# EAGLE schematic rpi_breakout (EAGLE 6.1)
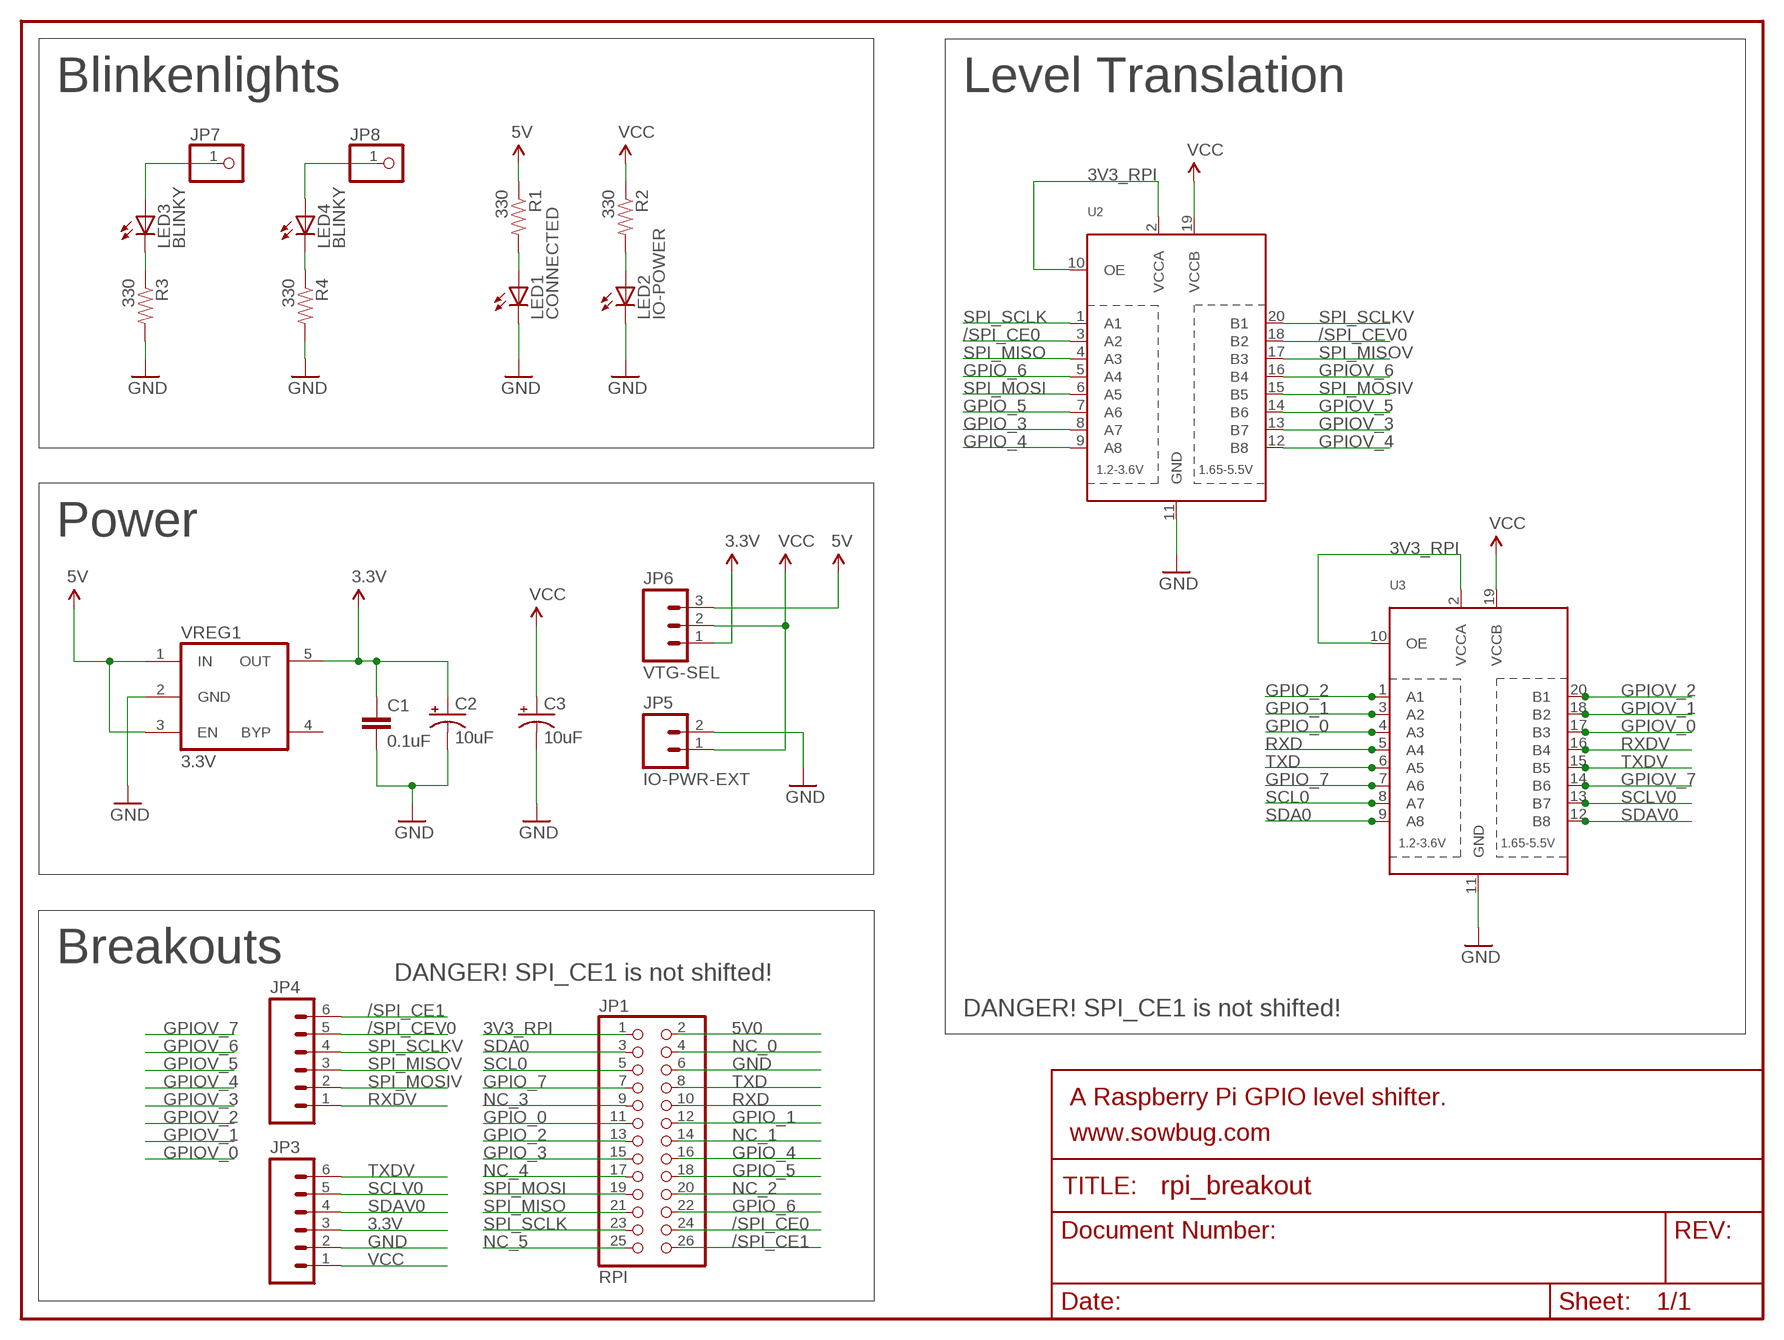
[diagram p0: schematic, sheet 1]

## Parts
C1  0.1uF  CAP0805  [0805]
C2  10uF  CAP_POL1206  [EIA3216]
C3  10uF  CAP_POL1206  [EIA3216]
JP1  RPI  PINHD-2X13  [2X13]
JP3  M06FEMALE_LOCK  [1X06_FEMALE_LOCK.010]
JP4  M06FEMALE_LOCK  [1X06_FEMALE_LOCK.010]
JP5  IO-PWR-EXT  M02PTH  [1X02]
JP6  VTG-SEL  M03PTH  [1X03]
JP7  PINHD-1X1CB  [1X01-CLEANBIG]
JP8  PINHD-1X1CB  [1X01-CLEANBIG]
LED1  CONNECTED  LEDCHIPLED_0805  [CHIPLED_0805]
LED2  IO-POWER  LEDCHIPLED_0805  [CHIPLED_0805]
LED3  BLINKY  LEDCHIPLED_0805  [CHIPLED_0805]
LED4  BLINKY  LEDCHIPLED_0805  [CHIPLED_0805]
R1  330  RESISTOR0805-RES  [0805]
R2  330  RESISTOR0805-RES  [0805]
R3  330  RESISTOR0805-RES  [0805]
R4  330  RESISTOR0805-RES  [0805]
U2  TXB0108PWR  [TSSOP20]
U3  TXB0108PWR  [TSSOP20]
VREG1  3.3V  IC_VREG_5PINS-SOT-23-5  [SOT-23-5]

## Nets
3.3V [power/gnd]: C1.1 C2.A(+) JP3.3 JP6.1 VREG1.5(OUT)
3V3_RPI: JP1.1 U2.2(VCCA) U2.10(OE) U3.2(VCCA) U3.10(OE)
5V [power/gnd]: JP6.3 R1.1 VREG1.1(IN) VREG1.3(EN)
5V0: JP1.2
/SPI_CE0: JP1.24 U2.3(A2)
/SPI_CE1: JP1.26 JP4.6
/SPI_CEV0: JP4.5 U2.18(B2)
GND [power/gnd]: C1.2 C2.C(-) C3.C(-) JP1.6 JP3.2 JP5.2 LED1.C LED2.C R3.2 R4.2 U2.11(GND) U3.11(GND) VREG1.2(GND)
GPIO_0: JP1.11 U3.4(A3)
GPIO_1: JP1.12 U3.3(A2)
GPIO_2: JP1.13 U3.1(A1)
GPIO_3: JP1.15 U2.8(A7)
GPIO_4: JP1.16 U2.9(A8)
GPIO_5: JP1.18 U2.7(A6)
GPIO_6: JP1.22 U2.5(A4)
GPIO_7: JP1.7 U3.7(A6)
GPIOV_0: JP2.1 U3.17(B3)
GPIOV_1: JP2.2 U3.18(B2)
GPIOV_2: JP2.3 U3.20(B1)
GPIOV_3: JP2.4 U2.13(B7)
GPIOV_4: JP2.5 U2.12(B8)
GPIOV_5: JP2.6 U2.14(B6)
GPIOV_6: JP2.7 U2.16(B4)
GPIOV_7: JP2.8 U3.14(B6)
LED3_JP: JP7.1 LED3.A
LED4_JP: JP8.1 LED4.A
N$1: LED1.A R1.2
N$2: LED2.A R2.2
N$3: LED3.C R3.1
N$4: LED4.C R4.1
NC_0: JP1.4
NC_1: JP1.14
NC_2: JP1.20
NC_3: JP1.9
NC_4: JP1.17
NC_5: JP1.25
RXD: JP1.10 U3.5(A4)
RXDV: JP4.1 U3.16(B4)
SCL0: JP1.5 U3.8(A7)
SCLV0: JP3.5 U3.13(B7)
SDA0: JP1.3 U3.9(A8)
SDAV0 [skinny]: JP3.4 U3.12(B8)
SPI_MISO: JP1.21 U2.4(A3)
SPI_MISOV: JP4.3 U2.17(B3)
SPI_MOSI: JP1.19 U2.6(A5)
SPI_MOSIV: JP4.2 U2.15(B5)
SPI_SCLK: JP1.23 U2.1(A1)
SPI_SCLKV: JP4.4 U2.20(B1)
TXD: JP1.8 U3.6(A5)
TXDV: JP3.6 U3.15(B5)
VCC [power/gnd]: C3.A(+) JP3.1 JP5.1 JP6.2 R2.1 U2.19(VCCB) U3.19(VCCB)
Unconnected: VREG1.4(BYP)

## Notes on the sheet
- Blinkenlights | Level Translation
- Power
- Breakouts
- DANGER! SPI_CE1 is not shifted!
- DANGER! SPI_CE1 is not shifted!
- A Raspberry Pi GPIO level shifter.
- www.sowbug.com

## Library data of the parts
C1 = SparkFun:CAP: Capacitor Standard 0603 ceramic capacitor, and 0.1" leaded capacitor.
C2 C3 = SparkFun:CAP_POL: Capacitor Polarized These are standard SMD and PTH capacitors. Normally 10uF, 47uF, and 100uF in electrolytic and tantalum varieties. Always verify the external diameter of the through hole cap, it varies with capacity, voltage, and manufacturer. The EIA devices should be standard.
JP1 = pinhead:PINHD-2X13: PIN HEADER
JP3 JP4 = SparkFun:M06: Header 6 Standard 6-pin 0.1" header. Use with straight break away headers (SKU : PRT-00116), right angle break away headers (PRT-00553), swiss pins (PRT-00743), machine pins (PRT-00117), and female headers (PRT-00115). Molex polarized connector foot print use with SKU : PRT-08094 with associated crimp pins and housings. NOTES ON THE VARIANTS LOCK and LOCK_LONGPADS... This footprint was designed to help hold the alignment of a through-hole component (i.e. 6-pin header) while soldering it into place. You may notice that each hole has been shifted either up or down by 0.005 of an inch from it's more standard position (which is a perfectly straight line). This slight alteration caused the pins (the squares in the middle) to touch the edges of the holes. Because they are alternating, it causes a "brace" to hold the component in place. 0.005 has proven to be the perfect amount of "off-center" position when using our standard breakaway headers. Although looks a little odd when you look at the bare footprint, once you have a header in there, the alteration is very hard to notice. Also, if you push a header all the way into place, it is covered up entirely on the bottom side. This idea of altering the position of holes to aid alignment will be further integrated into the Sparkfun Library for other footprints. It can help hold any component with 3 or more connection pins.
JP5 = SparkFun:M02: Header 2 Standard 2-pin 0.1" header. Use with straight break away headers (SKU : PRT-00116), right angle break away headers (PRT-00553), swiss pins (PRT-00743), machine pins (PRT-00117), and female headers (PRT-00115). Molex polarized connector foot print use with SKU : PRT-08233 with associated crimp pins and housings.
JP6 = SparkFun:M03: Header 3 Standard 3-pin 0.1" header. Use with straight break away headers (SKU : PRT-00116), right angle break away headers (PRT-00553), swiss pins (PRT-00743), machine pins (PRT-00117), and female headers (PRT-00115). Molex polarized connector foot print use with SKU : PRT-08232 with associated crimp pins and housings.
JP7 JP8 = adafruit:PINHD-1X1: Pin header 1x1 for 0.1" spacing With round pins
LED1-LED4 = adafruit:LED: LED OSRAM: - CHIPLED LG R971, LG N971, LY N971, LG Q971, LY Q971, LO R971, LY R971 LH N974, LH R974 LS Q976, LO Q976, LY Q976 LO Q996 - Hyper CHIPLED LW Q18S LB Q993, LB Q99A, LB R99A - SideLED LS A670, LO A670, LY A670, LG A670, LP A670 LB A673, LV A673, LT A673, LW A673 LH A674 LY A675 LS A676, LA A676, LO A676, LY A676, LW A676 LS A679, LY A679, LG A679 - Hyper Micro SIDELED® LS Y876, LA Y876, LO Y876, LY Y876 LT Y87S - SmartLED LW L88C, LW L88S LB L89C, LB L89S, LG L890 LS L89K, LO L89K, LY L89K LS L896, LA L896, LO L896, LY L896 - TOPLED LS T670, LO T670, LY T670, LG T670, LP T670 LSG T670, LSP T670, LSY T670, LOP T670, LYG T670 LG T671, LOG T671, LSG T671 LB T673, LV T673, LT T673, LW T673 LH T674 LS T676, LA T676, LO T676, LY T676, LB T676, LH T676, LSB T676, LW T676 LB T67C, LV T67C, LT T67C, LS T67K, LO T67K, LY T67K, LW E67C LS E67B, LA E67B, LO E67B, LY E67B, LB E67C, LV E67C, LT E67C LW T67C LS T679, LY T679, LG T679 LS T770, LO T770, LY T770, LG T770, LP T770 LB T773, LV T773, LT T773, LW T773 LH T774 LS E675, LA E675, LY E675, LS T675 LS T776, LA T776, LO T776, LY T776, LB T776 LHGB T686 LT T68C, LB T68C - Hyper Mini TOPLED® LB M676 - Mini TOPLED Santana® LG M470 LS M47K, LO M47K, LY M47K Source: http://www.osram.convergy.de/
R1-R4 = SparkFun:RESISTOR: Resistor Basic schematic elements and footprints for 0603, 1206, and PTH resistors.
U2 U3 = rpi_breakout:TXB0108PWR: 8-Bit Bi-Directional Level Shifter 1.2V-3.6V (VCCA) to 1.65V-5.5V (VCCB) bi-directional level shifter with auto direction sensing. Max data rate - VCCA 1.8V: 20Mbps (50ns), VCCA 3.3V: 100Mbps (10ns) Digikey: 296-21527-1-ND
VREG1 = dp_devices:IC_VREG_5PINS: 5 pins voltage regulator

## Net classes
0 default: width 0.254 mm, clearance 0.254 mm
1 power/gnd: width 0.406 mm, clearance 0.254 mm
2 skinny: width 0.203 mm, clearance 0.203 mm